# Altium project AIOESM.PrjPcb
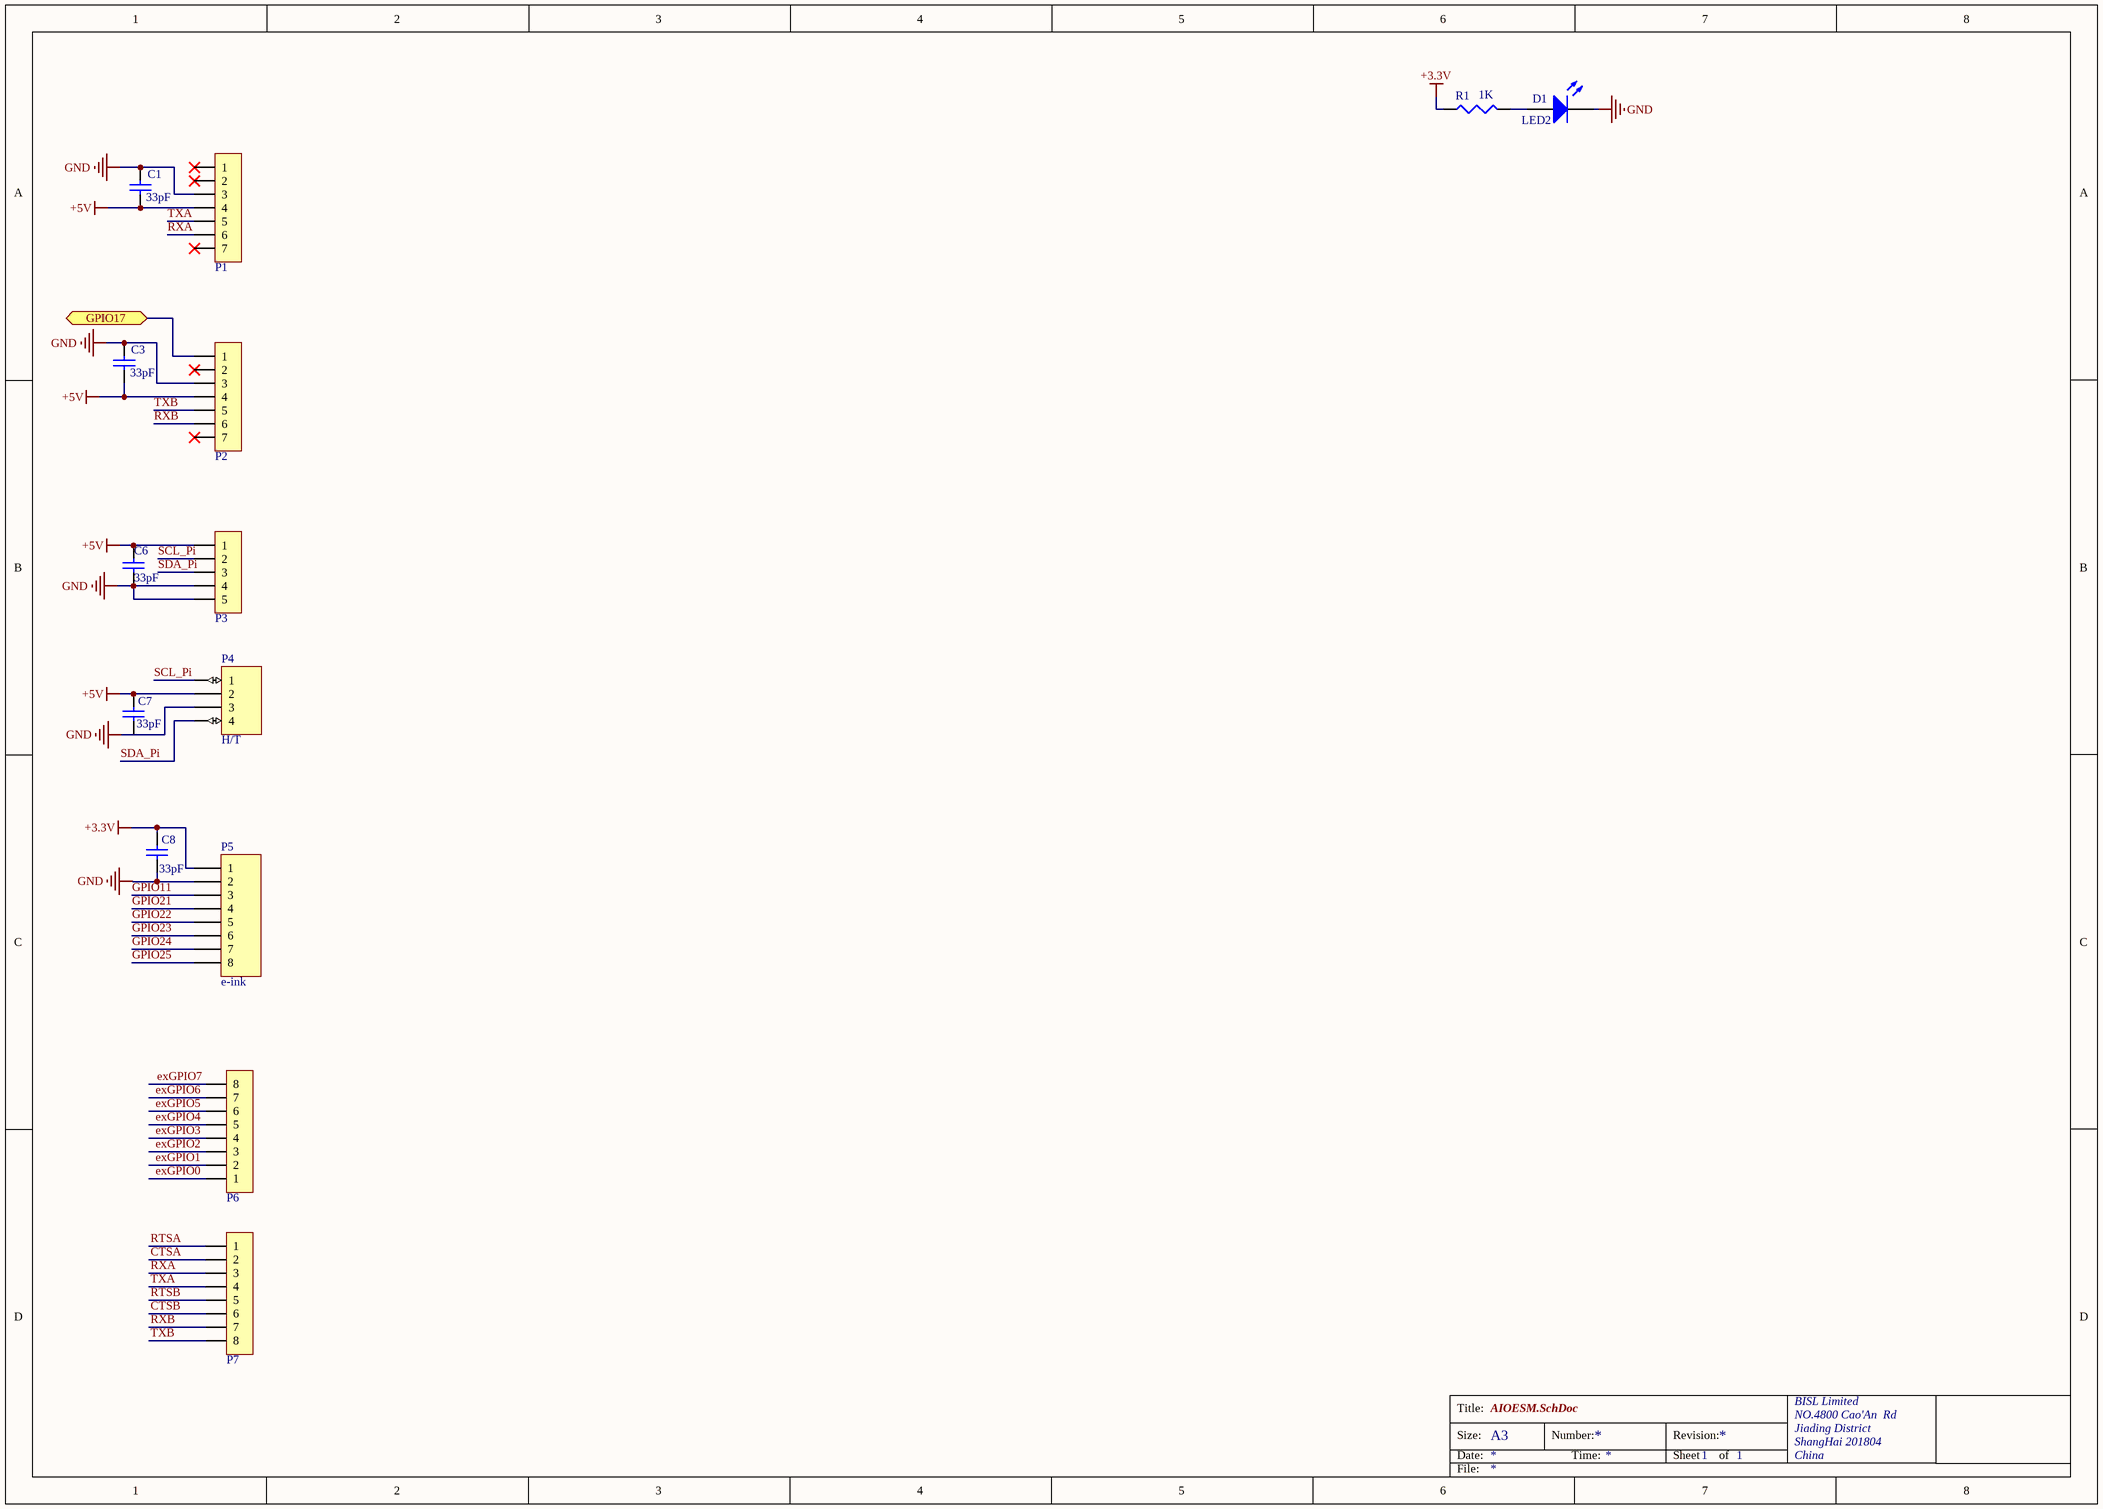
[diagram p0: AIOESM.SchDoc]
1 sheet, 14 parts. Net scope: flat (ports and power ports of the same name join across sheets).
Board file: AIOESM.PcbDoc

## Sheet AIOESM.SchDoc
size A3; SheetNumber: 1; SheetTotal: 1

### Parts
C1  value 33pF  [C 0603_L]  (hidden comment: Cap)
C3  value 33pF  [C 0603_L]  (hidden comment: Cap)
C6  value 33pF  [C 0603_L]  (hidden comment: Cap)
C7  value 33pF  [C 0603_L]  (hidden comment: Cap)
C8  value 33pF  [C 0603_L]  (hidden comment: Cap)
D1  LED2  [LED 0603Y]
P1  HDR-1X7  [MX 1.25-WI-7P]  (value not drawn)
P2  HDR-1X7  [MX 1.25-WI-7P]  (value not drawn)
P3  HDR-1X5  [ZH1.5-WI-5P]  (value not drawn)
P4  H/T  [PH2.0MM- 4]
P5  e-ink  [PH2.0MM-8]
P6  HDR-1X8  [HDR2.54-LI-8P]  (value not drawn)
P7  HDR-1X8  [HDR2.54-LI-8P]  (value not drawn)
R1  value 1K  [J1-0603]  (hidden comment: Res3)

### Ports
GPIO17 (bidir)

### Nets
+3.3V: C8.2 P5.1 R1.1
+5V: C1.1 C3.1 C6.2 C7.2 P1.4 P2.4 P3.1 P4.2
GND: C1.2 C3.2 C6.1 C8.1 D1.2(K) P1.3 P2.3 P3.4 P3.5 P4.3 P5.2
CTSA: P7.2
CTSB: P7.6
exGPIO0: P6.1
exGPIO1: P6.2
exGPIO2: P6.3
exGPIO3: P6.4
exGPIO4: P6.5
exGPIO5: P6.6
exGPIO6: P6.7
exGPIO7: P6.8
GPIO11: P5.3
GPIO21: P5.4
GPIO22: P5.5
GPIO23: P5.6
GPIO24: P5.7
GPIO25: P5.8
RTSA: P7.1
RTSB: P7.5
RXA: P1.6 P7.3
RXB: P2.6 P7.7
SCL_Pi: P3.2 P4.1
SDA_Pi: P3.3 P4.4
TXA: P1.5 P7.4
TXB: P2.5 P7.8
NetD1_1: D1.1(A) R1.2
NetP2_1: P2.1 ; port GPIO17

Not connected (* = marked no-connect by the designer): C7 1; P1 1* 2* 7*; P2 2* 7*

### Notes on the sheet
- Title:
- Size:
- Date:
- A3
- Number:
- Time:
- Revision:
- Sheet
- of
- BISL Limited
- NO.4800 Cao'An  Rd
- Jiading District
- ShangHai 201804
- China
- File:

### Library data of the parts
C1 C3 C6-C8 = Cap: Capacitor; Published: 8-Jun-2000; LatestRevisionDate: 17-Jul-2002; LatestRevisionNote: Re-released for DXP Platform.; PackageReference: RAD-0.3; Publisher: Altium Limited; PackageDescription: Radial Cap, Thru-Hole; 2 Leads; 0.3 in Pin Spacing
D1 = LED2: Typical RED, GREEN, YELLOW, AMBER GaAs LED; Published: 8-Jun-2000; LatestRevisionDate: 17-Jul-2002; LatestRevisionNote: Re-released for DXP Platform.; PackageVersion: Feb-2002; PackageReference: 3.2X1.6X1.1; Publisher: Altium Limited; PackageDescription: SM LED; 2 Flat Leads
P1 P2 = Header 7: 7P接插件; 版权归属: 封装库来自淘宝 ID：黄晶宝石; BOM名称: 7P接插件; 学习资源: https://shop463601444.taobao.com
P3 = Header 5: 5P接插件; 学习资源: 封装库来自淘宝 ID：黄晶宝石; BOM名称: 5P接插件; 版权归属: https://shop463601444.taobao.com
P4 = Header 4: Header, 4-Pin; LatestRevisionDate: 17-Jul-2002; LatestRevisionNote: Re-released for DXP Platform.; Publisher: Altium Limited
P5 = Header 8: Header, 8-Pin; LatestRevisionDate: 17-Jul-2002; LatestRevisionNote: Re-released for DXP Platform.; Publisher: Altium Limited
P6 P7 = Header 8: 8P接插件; 版权归属: 封装库来自淘宝 ID：黄晶宝石; BOM名称: 8P接插件; 学习资源: https://shop463601444.taobao.com
R1 = Res3: Resistor; Published: 8-Jun-2000; LatestRevisionDate: 29-May-2009; LatestRevisionNote: IPC-7351 Footprint Added.; PackageReference: J1-0603; Publisher: Altium Limited; PackageDescription: Chip Resistor